# EAGLE design main (EAGLE 9.5.1)
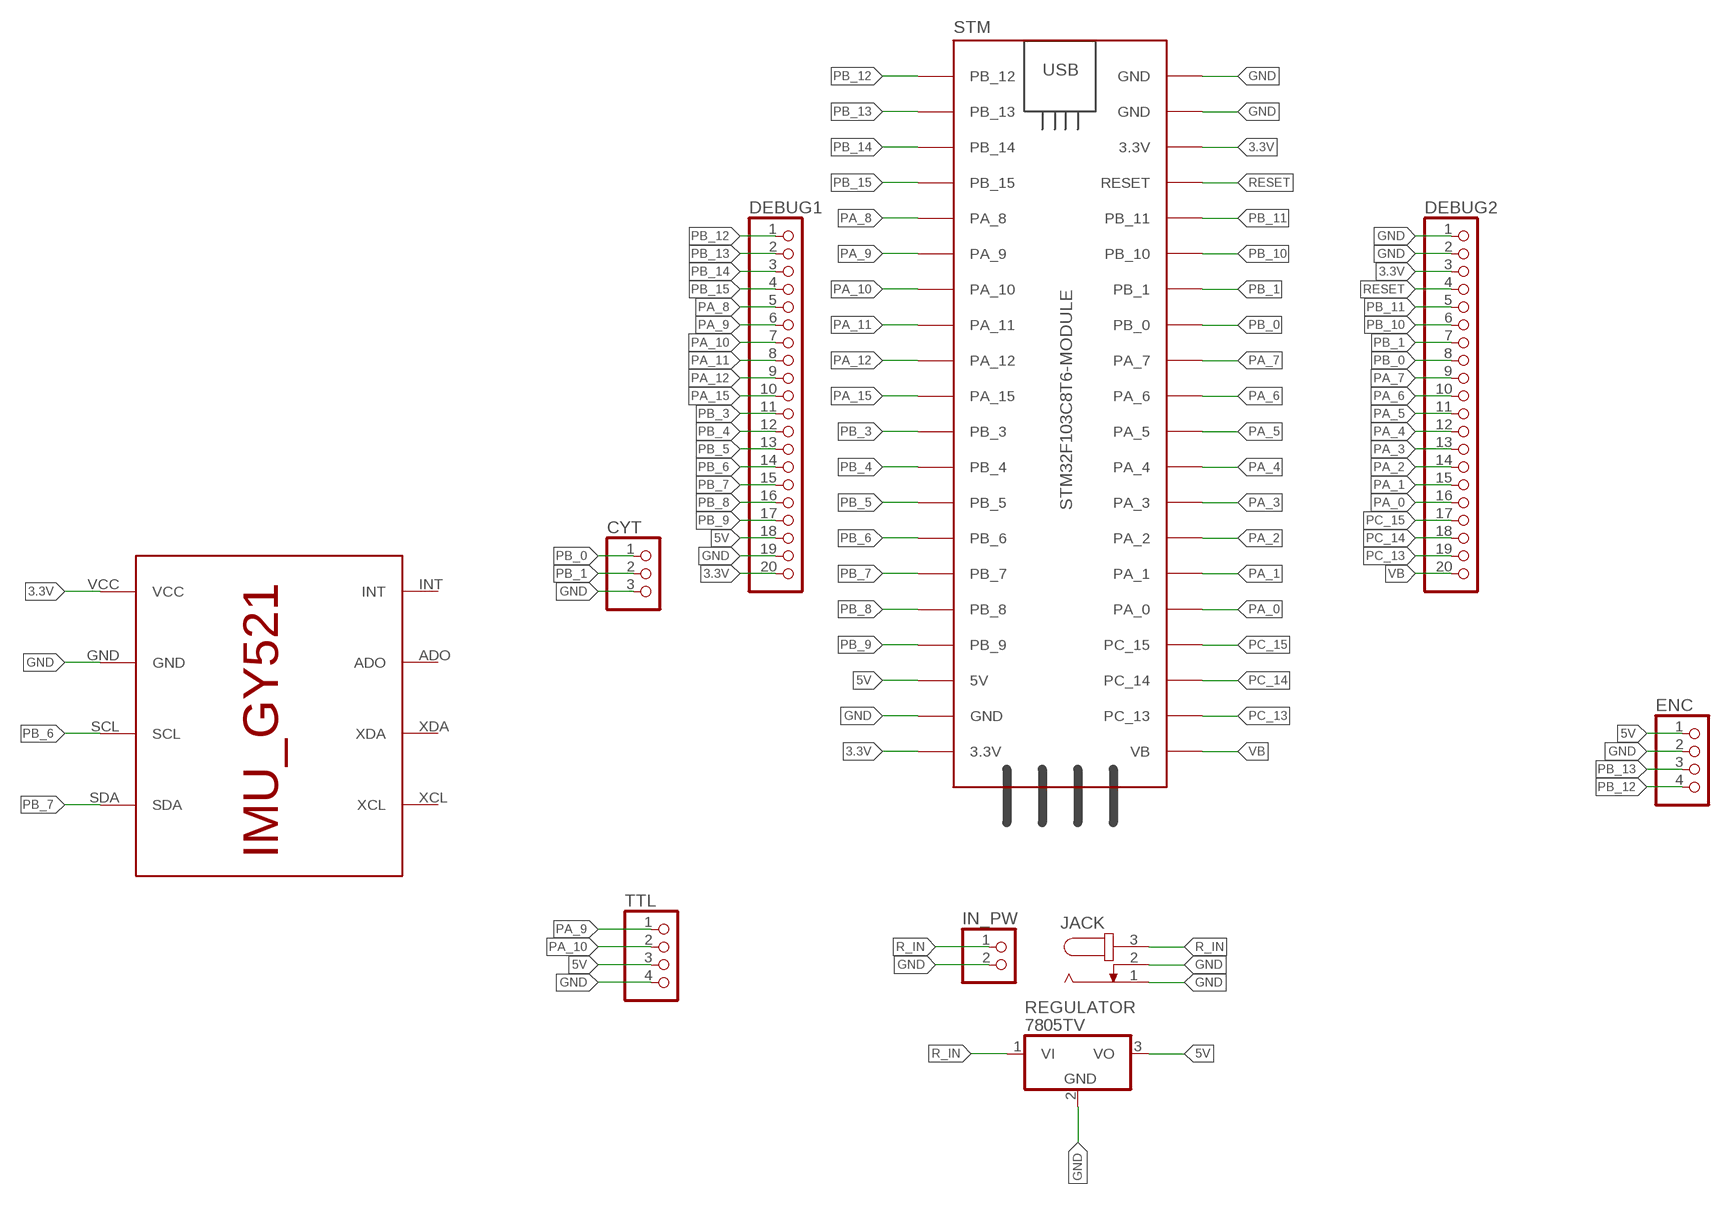
[diagram p0: schematic, sheet 1]

## Parts
CYT  PINHD-1X3  [1X03]
DEBUG1  PINHD-1X20  [1X20]
DEBUG2  PINHD-1X20  [1X20]
ENC  PINHD-1X4  [1X04]
IMU  IMU_ROBOCON_GY521  [IMU_GY521]
IN_PW  PINHD-2_DATA  [1X02_DATA]
JACK  JACK-PLUG0  [SPC4077]
REGULATOR  7805TV  [TO220V]
STM  STM32F103C8T6-MODULE  [STM32F103C8T6-MODULE]
TTL  PINHD-1X4  [1X04]

## Nets
3.3V: DEBUG1.20 DEBUG2.3 IMU.VCC STM.3.3V_1(3.3V) STM.3.3V_2(3.3V)
5V: DEBUG1.18 ENC.1 REGULATOR.3(VO) STM.5V TTL.3
GND: CYT.3 DEBUG1.19 DEBUG2.1 DEBUG2.2 ENC.2 IMU.GND IN_PW.2 JACK.1 JACK.2 REGULATOR.2(GND) STM.GND_1(GND) STM.GND_2(GND) STM.GND_3(GND) TTL.4
PA_0: DEBUG2.16 STM.PA_0
PA_1: DEBUG2.15 STM.PA_1
PA_2: DEBUG2.14 STM.PA_2
PA_3: DEBUG2.13 STM.PA_3
PA_4: DEBUG2.12 STM.PA_4
PA_5: DEBUG2.11 STM.PA_5
PA_6: DEBUG2.10 STM.PA_6
PA_7: DEBUG2.9 STM.PA_7
PA_8: DEBUG1.5 STM.PA_8
PA_9: DEBUG1.6 STM.PA_9 TTL.1
PA_10: DEBUG1.7 STM.PA_10 TTL.2
PA_11: DEBUG1.8 STM.PA_11
PA_12: DEBUG1.9 STM.PA_12
PA_15: DEBUG1.10 STM.PA_15
PB_0: CYT.1 DEBUG2.8 STM.PB_0
PB_1: CYT.2 DEBUG2.7 STM.PB_1
PB_3: DEBUG1.11 STM.PB_3
PB_4: DEBUG1.12 STM.PB_4
PB_5: DEBUG1.13 STM.PB_5
PB_6: DEBUG1.14 IMU.SCL STM.PB_6
PB_7: DEBUG1.15 IMU.SDA STM.PB_7
PB_8: DEBUG1.16 STM.PB_8
PB_9: DEBUG1.17 STM.PB_9
PB_10: DEBUG2.6 STM.PB_10
PB_11: DEBUG2.5 STM.PB_11
PB_12: DEBUG1.1 ENC.4 STM.PB_12
PB_13: DEBUG1.2 ENC.3 STM.PB_13
PB_14: DEBUG1.3 STM.PB_14
PB_15: DEBUG1.4 STM.PB_15
PC_13: DEBUG2.19 STM.PC_13
PC_14: DEBUG2.18 STM.PC_14
PC_15: DEBUG2.17 STM.PC_15
R_IN: IN_PW.1 JACK.3 REGULATOR.1(VI)
RESET: DEBUG2.4 STM.RESET
VB: DEBUG2.20 STM.VB
Unconnected: IMU.ADO IMU.INT IMU.XCL IMU.XDA

## Library data of the parts
CYT = MIA-Training:PINHD-1X3: PIN HEADER
DEBUG1 DEBUG2 = MIA-Training:PINHD-1X20: PIN HEADER
ENC TTL = MIA-Training:PINHD-1X4: PIN HEADER
IMU = MIA_LIBRARY-2-2-2:IMU_ROBOCON_GY521
IN_PW = MIA_LIBRARY-2-2-2:PINHD-2_DATA: PIN HEADER
JACK = con-jack:JACK-PLUG: DC POWER JACK Power Jack, DC, Right Angle, Through Hole, Rated 5A at 16VDC, PC Terminals Distributor: Farnell (www.Farnell.de) Drawing: 84N1161.pdf / 84N1162.pdf Manufacturer: SPC Technology (www.spctechnology.com) Type: SPC4077 / SPC 4078; OC_FARNELL: unknown; OC_NEWARK: unknown
REGULATOR = linear:78*: Positive VOLTAGE REGULATOR Source: http://cache.national.com/ds/LM/LM78L05.pdf http://www.fairchildsemi.com/ds/LM/LM7805.pdf
STM = MIA_LIBRARY-2-2-2:STM32F103C8T6-MODULE: STM32F103C8T6 module with ARM Cortex-3, 20kB SRAM, 64kB Flash, 72MHz

## Board
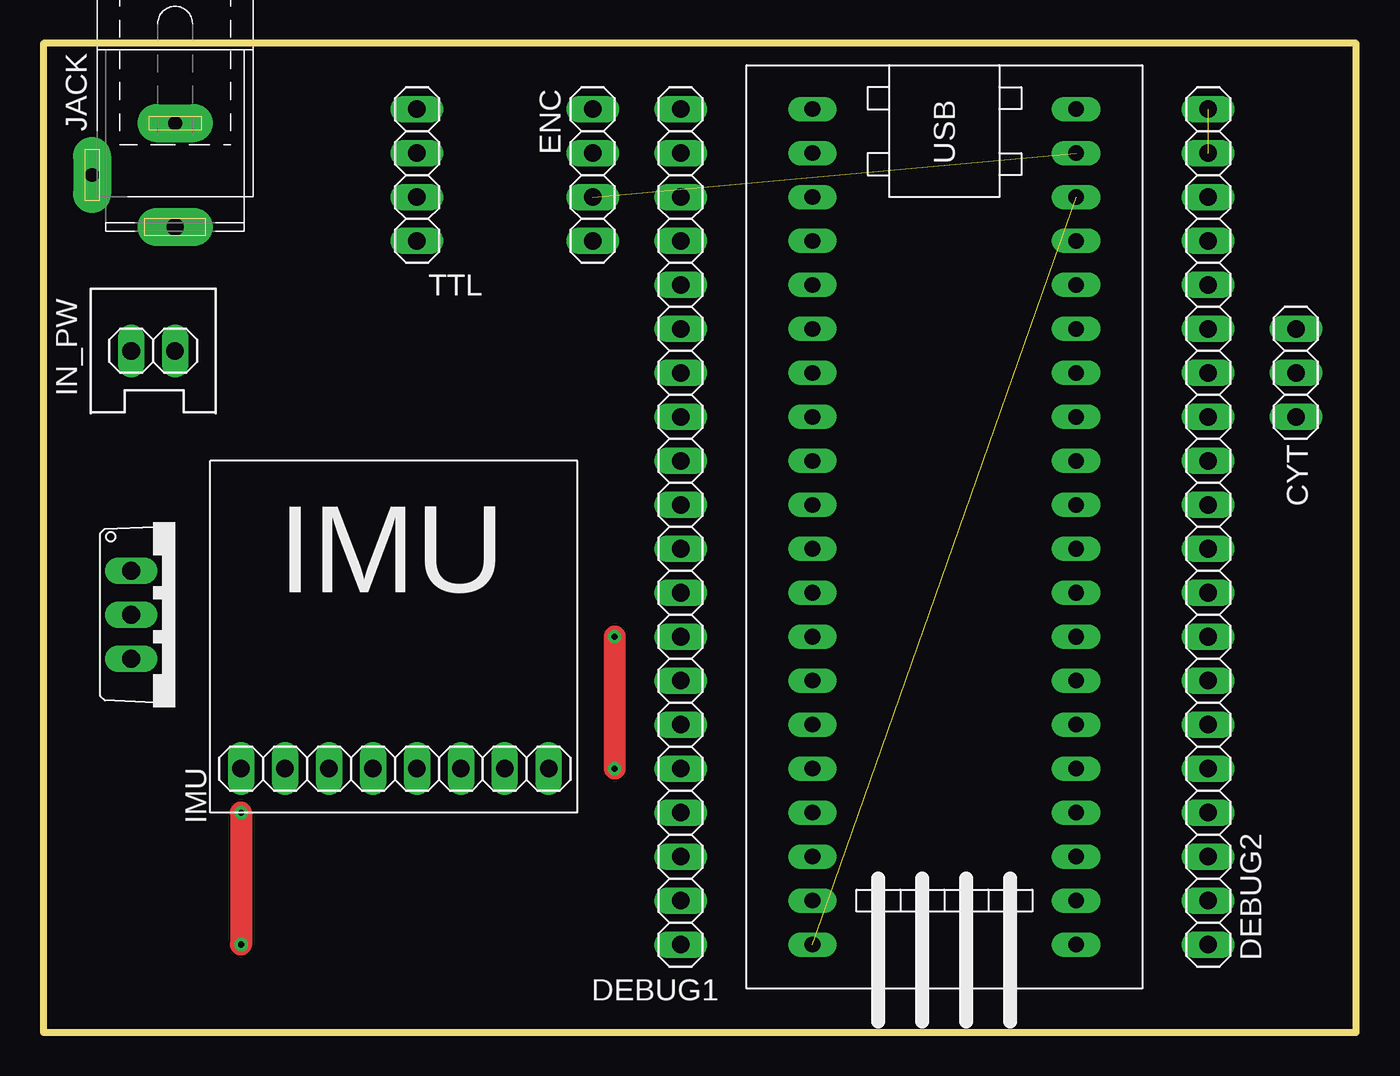
[diagram p1: board, top side]
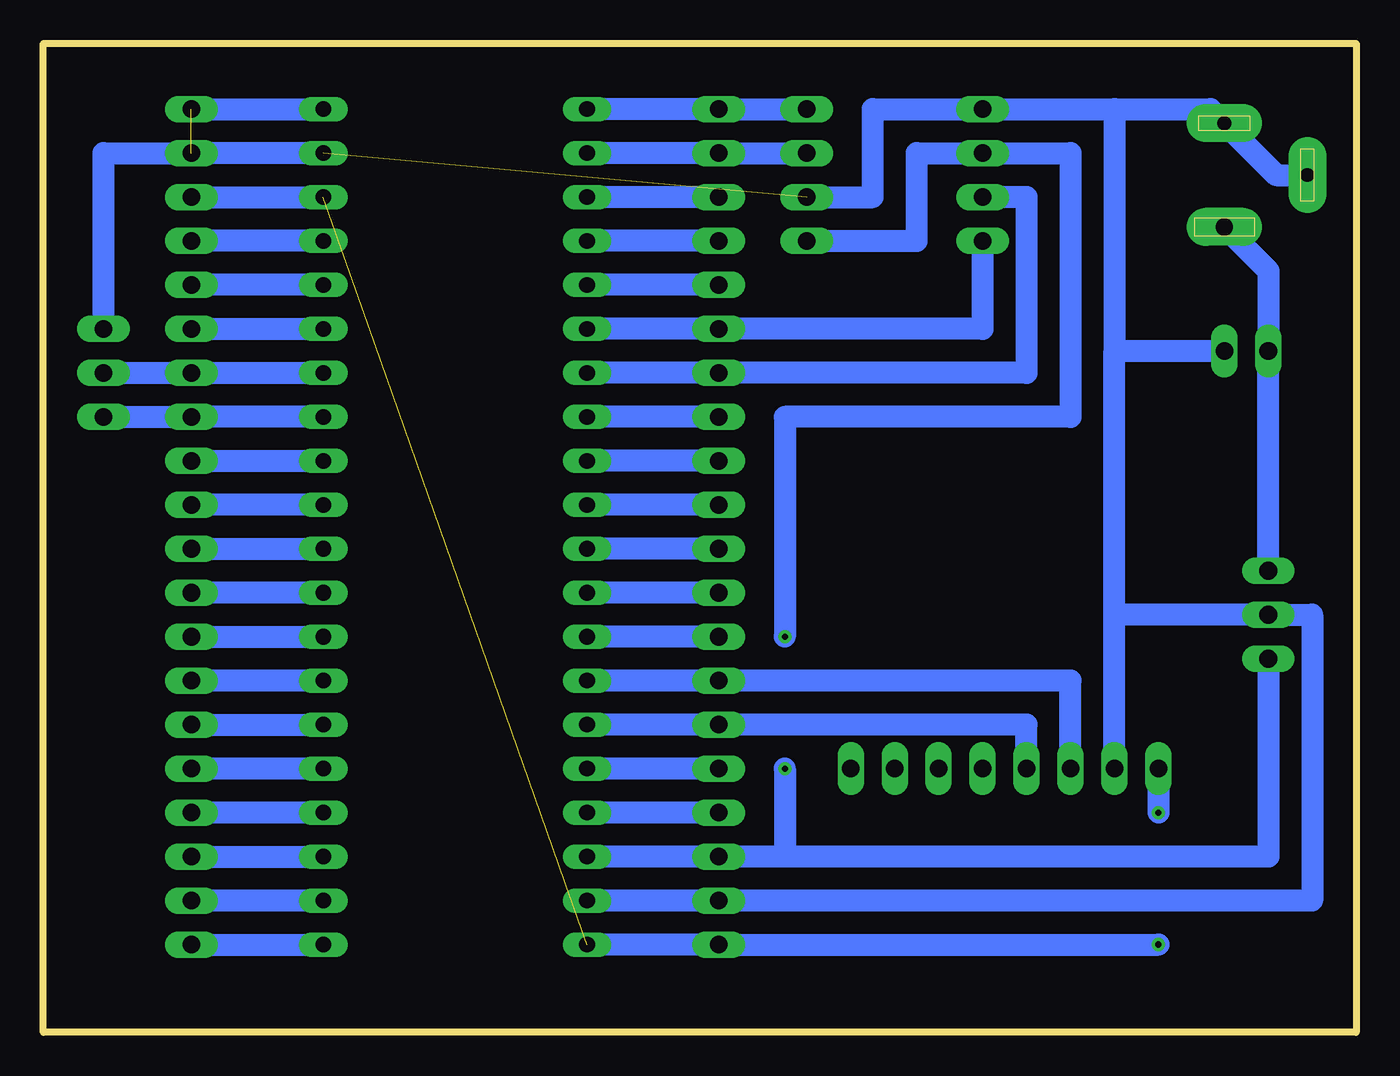
[diagram p2: board, bottom side, seen from below]

Size 75.87 x 57.14 mm. Coordinates in mm from the lower left corner, seen from the top.
Outline: 0,0 75.87,0 75.87,57.14 0,57.14 0,0
Copper layers (1*16): Top 0.035mm / dielectric 1.5mm / Bottom 0.035mm
Design rules "default": minimum track width 6mil, minimum drill 0.35mm, track to track 6mil, track to pad 6mil, pad to pad 6mil, via to via 6mil, smd to smd 6mil, copper to edge 40mil, drill to drill 6mil, minimum pad ring 10mil, minimum via ring 8mil, stop-mask expansion 4mil, vias tented up to drill 0mil, thermal gap 10mil

### Footprints (pad centres in the part's own frame; a part is rotated, then mirrored left to right if it is on the bottom)
1X03 = drill 1.016 long: 1 -2.54,0; 2 0,0; 3 2.54,0
1X20 = drill 1.016 long: 1 -24.13,0; 2 -21.59,0; 3 -19.05,0; 4 -16.51,0; 5 -13.97,0; 6 -11.43,0; 7 -8.89,0; 8 -6.35,0; 9 -3.81,0; 10 -1.27,0; 11 1.27,0; 12 3.81,0; 13 6.35,0; 14 8.89,0; 15 11.43,0; 16 13.97,0; 17 16.51,0; 18 19.05,0; 19 21.59,0; 20 24.13,0
1X04 = drill 1.016 long: 1 -3.81,0; 2 -1.27,0; 3 1.27,0; 4 3.81,0
IMU_GY521 = drill 1.016 long: ADO -6.35,0; GND 6.35,0; INT -8.89,0; SCL 3.81,0; SDA 1.27,0; VCC 8.89,0; XCL -3.81,0; XDA -1.27,0
1X02_DATA = drill 1.016 long: 1 -1.27,0; 2 1.27,0
SPC4077 = drill 0.8 pad 2.184 long: 1 -3,0; 2 0,-4.8 | drill 1 pad 2.184 long: 3 3,0
TO220V = drill 1.016 long: 1 -2.54,-2.54; 2 0,-2.54; 3 2.54,-2.54
STM32F103C8T6-MODULE = drill 0.9 long: 3.3V_1 25.4,-7.62; 3.3V_2 -17.78,7.62; 5V 20.32,-7.62; GND_1 22.86,-7.62; GND_2 -20.32,7.62; GND_3 -22.86,7.62; PA_0 15.24,7.62; PA_1 12.7,7.62; PA_2 10.16,7.62; PA_3 7.62,7.62; PA_4 5.08,7.62; PA_5 2.54,7.62; PA_6 0,7.62; PA_7 -2.54,7.62; PA_8 -12.7,-7.62; PA_9 -10.16,-7.62; PA_10 -7.62,-7.62; PA_11 -5.08,-7.62; PA_12 -2.54,-7.62; PA_15 0,-7.62; PB_0 -5.08,7.62; PB_1 -7.62,7.62; PB_3 2.54,-7.62; PB_4 5.08,-7.62; PB_5 7.62,-7.62; PB_6 10.16,-7.62; PB_7 12.7,-7.62; PB_8 15.24,-7.62; PB_9 17.78,-7.62; PB_10 -10.16,7.62; PB_11 -12.7,7.62; PB_12 -22.86,-7.62; PB_13 -20.32,-7.62; PB_14 -17.78,-7.62; PB_15 -15.24,-7.62; PC_13 22.86,7.62; PC_14 20.32,7.62; PC_15 17.78,7.62; RESET -15.24,7.62; VB 25.4,7.62

### Placement (x,y rotation side)
CYT  72.39,38.1 90 top
DEBUG1  36.83,29.21 270 top
DEBUG2  67.31,29.21 270 top
ENC  31.75,49.53 90 top
IMU  20.32,15.24 180 top
IN_PW  6.35,39.37 0 top
JACK  7.62,49.53 270 top
REGULATOR  7.62,24.13 270 top
STM  52.07,30.48 270 top
TTL  21.59,49.53 90 top

### Tracks (layer width: path | path; a pad name or v marks a point on that pad's centre or on a via)
3.3V  (via drill 0.35)  (1 unrouted)
  Top 1.27: v11.43,12.7 v11.43,5.08
  Bottom 1.27: v11.43,5.08 DEBUG1.20 STM.3.3V_1 | DEBUG2.3 STM.3.3V_2 | IMU.VCC v11.43,12.7
5V  (via drill 0.35)
  Top 1.27: v33.02,22.86 v33.02,15.24
  Bottom 1.27: REGULATOR.3 5.08,10.16 33.02,10.16 | v33.02,15.24 33.02,10.16 | 33.02,10.16 DEBUG1.18 STM.5V | ENC.1 25.4,45.72 25.4,50.8 TTL.3 16.51,50.8 16.51,35.56 33.02,35.56 v33.02,22.86
GND  (2 unrouted)
  Bottom 1.27: JACK.2 4.62,49.53 JACK.1 8.43,53.34 13.97,53.34 | 13.97,24.13 REGULATOR.2 2.54,24.13 2.54,7.62 DEBUG1.19 STM.GND_1 | CYT.3 72.39,50.8 DEBUG2.2 STM.GND_2 | 13.97,53.34 TTL.4 27.94,53.34 27.94,48.26 ENC.2 | DEBUG2.1 STM.GND_3 | IMU.GND 13.97,24.13 | 13.97,39.37 IN_PW.2 | 13.97,53.34 13.97,39.37 | 13.97,24.13 13.97,39.37
PA_0
  Bottom 1.27: STM.PA_0 DEBUG2.16
PA_1
  Bottom 1.27: DEBUG2.15 STM.PA_1
PA_2
  Bottom 1.27: STM.PA_2 DEBUG2.14
PA_3
  Bottom 1.27: DEBUG2.13 STM.PA_3
PA_4
  Bottom 1.27: STM.PA_4 DEBUG2.12
PA_5
  Bottom 1.27: DEBUG2.11 STM.PA_5
PA_6
  Bottom 1.27: STM.PA_6 DEBUG2.10
PA_7
  Bottom 1.27: DEBUG2.9 STM.PA_7
PA_8
  Bottom 1.27: DEBUG1.5 STM.PA_8
PA_9
  Bottom 1.27: TTL.1 21.59,40.64 DEBUG1.6 STM.PA_9
PA_10
  Bottom 1.27: TTL.2 19.05,48.26 19.05,38.1 DEBUG1.7 STM.PA_10
PA_11
  Bottom 1.27: DEBUG1.8 STM.PA_11
PA_12
  Bottom 1.27: DEBUG1.9 STM.PA_12
PA_15
  Bottom 1.27: DEBUG1.10 STM.PA_15
PB_0
  Bottom 1.27: STM.PB_0 DEBUG2.8 CYT.1
PB_1
  Bottom 1.27: CYT.2 DEBUG2.7 STM.PB_1
PB_3
  Bottom 1.27: DEBUG1.11 STM.PB_3
PB_4
  Bottom 1.27: DEBUG1.12 STM.PB_4
PB_5
  Bottom 1.27: DEBUG1.13 STM.PB_5
PB_6
  Bottom 1.27: STM.PB_6 DEBUG1.14 16.51,20.32 IMU.SCL
PB_7
  Bottom 1.27: STM.PB_7 DEBUG1.15 19.05,17.78 IMU.SDA
PB_8
  Bottom 1.27: DEBUG1.16 STM.PB_8
PB_9
  Bottom 1.27: DEBUG1.17 STM.PB_9
PB_10
  Bottom 1.27: DEBUG2.6 STM.PB_10
PB_11
  Bottom 1.27: STM.PB_11 DEBUG2.5
PB_12
  Bottom 1.27: STM.PB_12 DEBUG1.1 ENC.4
PB_13
  Bottom 1.27: STM.PB_13 DEBUG1.2 ENC.3
PB_14
  Bottom 1.27: DEBUG1.3 STM.PB_14
PB_15
  Bottom 1.27: DEBUG1.4 STM.PB_15
PC_13
  Bottom 1.27: STM.PC_13 DEBUG2.19
PC_14
  Bottom 1.27: DEBUG2.18 STM.PC_14
PC_15
  Bottom 1.27: STM.PC_15 DEBUG2.17
R_IN
  Bottom 1.27: 7.16,46.99 JACK.3 5.08,43.99 IN_PW.1 REGULATOR.1
RESET
  Bottom 1.27: STM.RESET DEBUG2.4
VB
  Bottom 1.27: DEBUG2.20 STM.VB